# EAGLE schematic untitled (EAGLE 6.4)
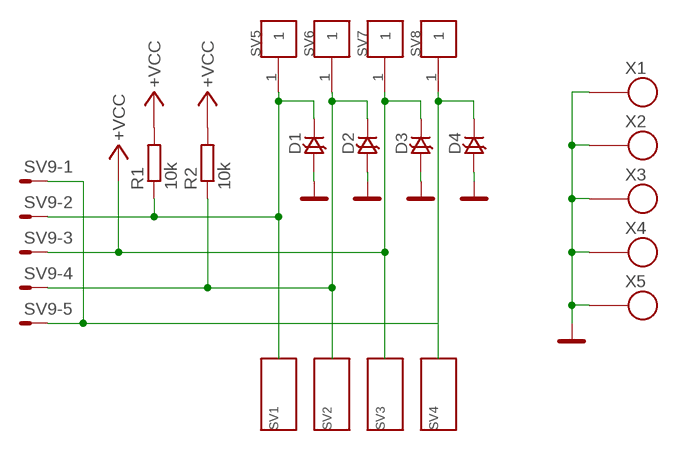
[diagram p0: schematic, sheet 1]

## Parts
D1  D-TRANSIL-SMA  [SMA]
D2  D-TRANSIL-SMA  [SMA]
D3  D-TRANSIL-SMA  [SMA]
D4  D-TRANSIL-SMA  [SMA]
R1  10k  R0805  [0805]
R2  10k  R0805  [0805]
SV1  WAGO256  [WAGO256]
SV2  WAGO256  [WAGO256]
SV3  WAGO256  [WAGO256]
SV4  WAGO256  [WAGO256]
SV5  SMD:MA01-01  [SMD_MA01-1]
SV6  SMD:MA01-01  [SMD_MA01-1]
SV7  SMD:MA01-01  [SMD_MA01-1]
SV8  SMD:MA01-01  [SMD_MA01-1]
SV9  MA05-1  [MA05-1]
X1  SROUB3M  [SROUB3M]
X2  SROUB3M  [SROUB3M]
X3  SROUB3M  [SROUB3M]
X4  SROUB3M  [SROUB3M]
X5  SROUB3M  [SROUB3M]

## Nets
+VCC: D3.K R1.2 R2.2 SV3.1 SV3.A1 SV7.1 SV9.3
GND: D1.A D2.A D3.A D4.A X1.P$1 X2.P$1 X3.P$1 X4.P$1 X5.P$1
N$2: D1.K R1.1 SV1.1 SV1.A1 SV5.1 SV9.2
N$3: D2.K R2.1 SV2.1 SV2.A1 SV6.1 SV9.4
N$5: D4.K SV4.1 SV4.A1 SV8.1 SV9.1 SV9.5

## Library data of the parts
D1-D4 = moje_diody:D-TRANSIL-SMA
R1 R2 = moje_R:R0805
SV1-SV4 = moje_konektory:WAGO256: WAGO256
SV5-SV8 = moje_hrebinky:SMD:MA01-01
SV9 = moje_hrebinky:MA05-1: PIN HEADER; OC_FARNELL: unknown; OC_NEWARK: unknown
X1-X5 = moje:SROUB3M